# Altium schematic sheet 02_Power.SchDoc
size A4
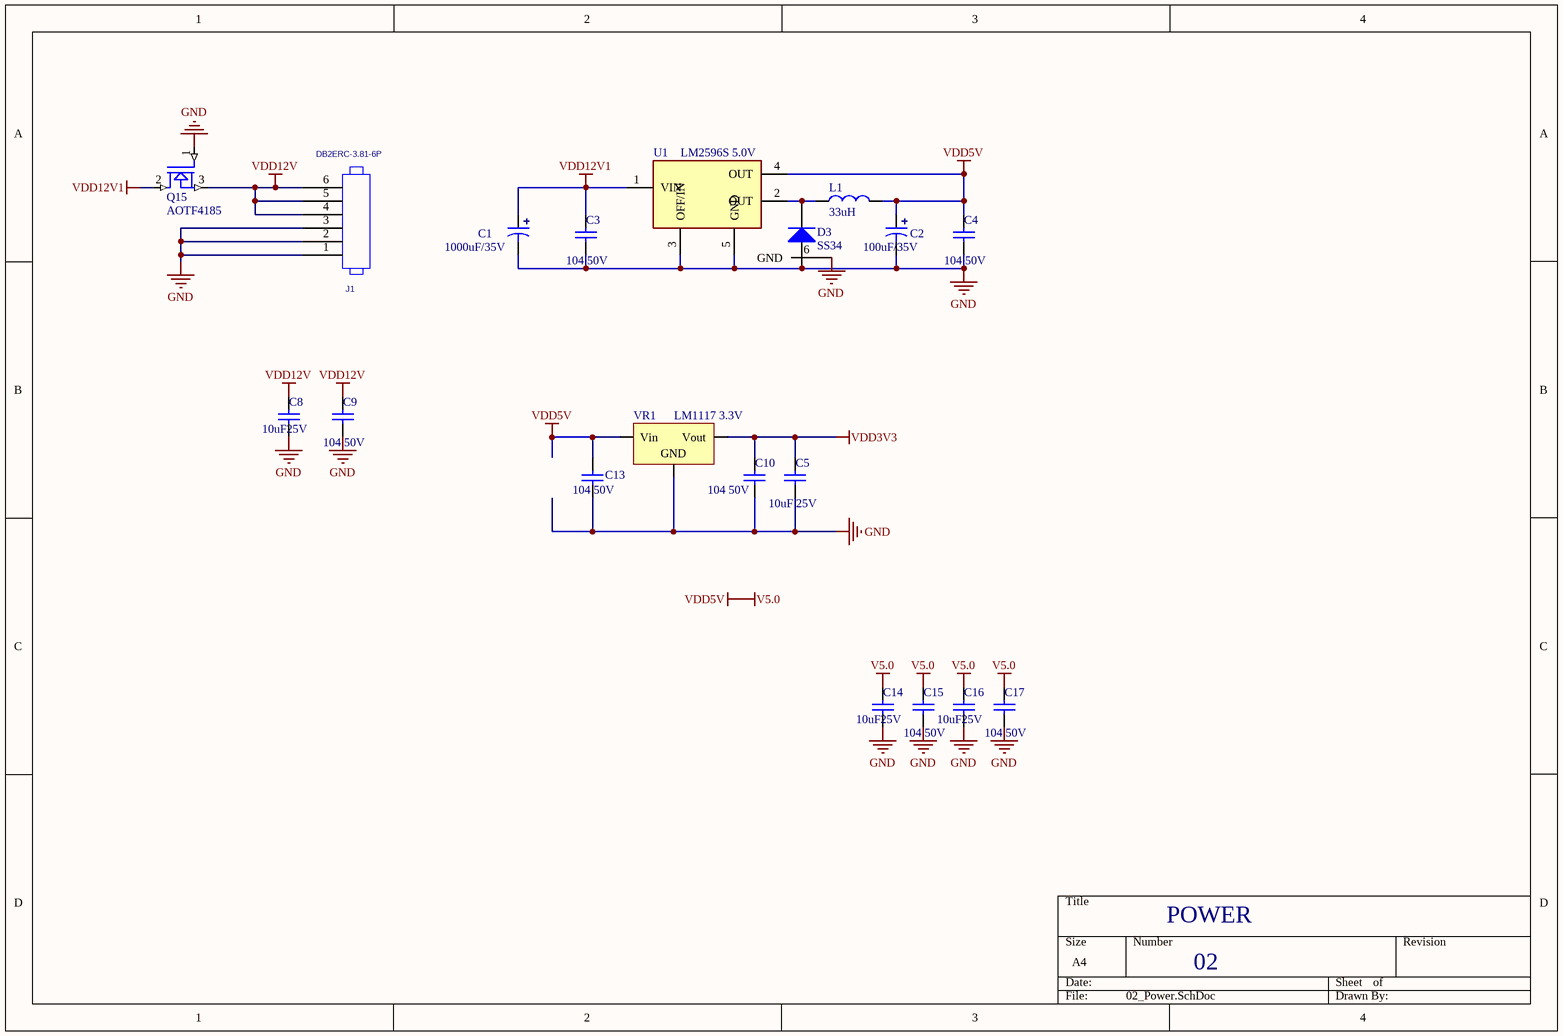
[diagram p0: 02_Power.SchDoc]

## Parts
C1  1000uF/35V  [10*16]
C2  100uF/35V  [6*8]
C3  104 50V  [SMD-0805C]
C4  104 50V  [SMD-0805C]
C5  10uF 25V  [SMD-0603C]
C8  10uF25V  [SMD-0603C]
C9  104 50V  [SMD-0603C]
C10  104 50V  [SMD-0603C]
C13  104 50V  [SMD-0603C]
C14  10uF25V  [SMD-0603C]
C15  104 50V  [SMD-0603C]
C16  10uF25V  [SMD-0603C]
C17  104 50V  [SMD-0603C]
D3  SS34  [SMA]
J1  value DB2ERC-3.81-6P  [VH-AW-3.96*6P]  (hidden comment: HEADER_6)
L1  33uH  [CDRH-127]
Q15  AOTF4185  [to220]
U1  LM2596S 5.0V  [TO-263-5]
VR1  LM1117 3.3V  [SOT223]

## Nets
GND: C1.2 C2.2 C3.1 C4.1 C5.1 C8.1 C9.1 C10.1 C13.1 C14.1 C15.1 C16.1 C17.1 D3.1(A) J1.1 J1.2 J1.3 Q15.1(G) U1.3(OFF/IN) U1.5(GND) U1.6(GND) VR1.1(GND)
V5.0: C2.1 C4.2 C13.2 C14.2 C15.2 C16.2 C17.2 L1.2 U1.4(OUT) VR1.3(Vin)  [also labelled VDD5V]
VDD3V3: C5.2 C10.2 VR1.2(Vout)
VDD12V: C8.2 C9.2 J1.4 J1.5 J1.6 Q15.3(S)
VDD12V1: C1.1 C3.2 Q15.2(D) U1.1(VIN)
NetD3_2: D3.2(K) L1.1 U1.2(OUT)

## Notes on the sheet
- POWER
- 02

## Library data of the parts
C1 C2 = CAP2: 电解电容
C3 C4 C8-C10 C13 = CAP4: 贴片电容 10%
C5 C14-C17 = CAP4: 贴片电容 20%
D3 = DIODE
J1 = HEADER_6: PCB DECAL: DB2ERC-3P81-6P; Source_Path: C:\MYPROGRAM\CADENCE\SPB_16.6\TOOLS\CAPTURE\LIBRARY\CONNECTOR.OLB
L1 = IND
Q15 = MOSFET N
U1 = LM2596
VR1 = LM1117: 三端稳压器